# Altium schematic sheet imd-monitoring.SchDoc: imd-monitoring
size A4; Date: 05.10.2017; CheckedBy: UNCHECKED; Author: Leon Loeser; Organization: Baltic Racing; Address1: Zur Schwedenschanze 15; Address2: Haus 18; Address3: 18435 Stralsund; Revision: xx.xx; SheetNumber: 3; SheetTotal: 9; Rules: EV6.3; ProjectName: Projekt
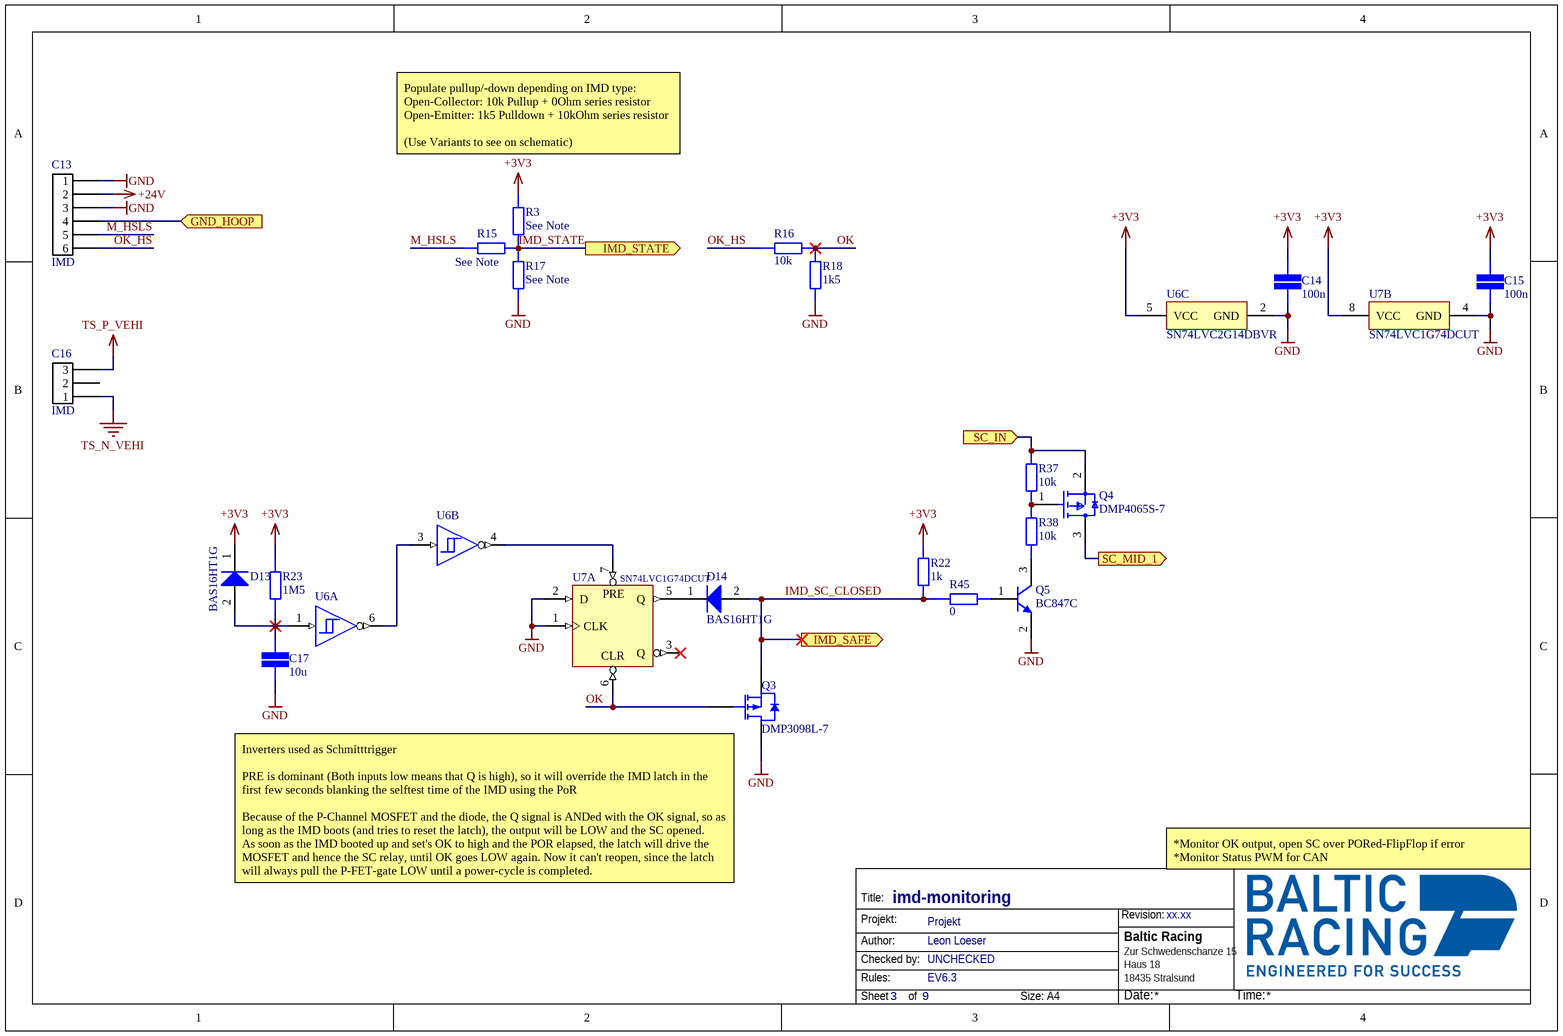
[diagram p0: imd-monitoring.SchDoc]

## Parts
C13  IMD  [43045-0612]
C14  value 100n  [CAP 0603/1608]  (hidden comment: SMD Capacitor)
C15  value 100n  [CAP 0603/1608]  (hidden comment: SMD Capacitor)
C16  IMD  [43650-0315]
C17  value 10u  [CAP 1206/3216]  (hidden comment: SMD Capacitor)
D13  BAS16HT1G  [ONSC-SOD-323-2-477-02_V]
D14  BAS16HT1G  [ONSC-SOD-323-2-477-02_V]
Q3  DMP3098L-7  [DIOD-SOT23-3_V]
Q4  DMP4065S-7  [FP-SOT23-MFG]
Q5  BC847C  [INF-SOT23_L]
R3  value See Note  [STACKPOLE CSR0603]  (hidden comment: SMD Resistor)
R15  value See Note  [STACKPOLE CSR0603]  (hidden comment: SMD Resistor)
R16  value 10k  [STACKPOLE CSR0603]  (hidden comment: SMD Resistor)
R17  value See Note  [STACKPOLE CSR0603]  (hidden comment: SMD Resistor)
R18  value 1k5  [STACKPOLE CSR0603]  (hidden comment: SMD Resistor)
R22  value 1k  [STACKPOLE CSR0603]  (hidden comment: SMD Resistor)
R23  value 1M5  [STACKPOLE CSR0603]  (hidden comment: SMD Resistor)
R37  value 10k  [STACKPOLE CSR0603]  (hidden comment: SMD Resistor)
R38  value 10k  [STACKPOLE CSR0603]  (hidden comment: SMD Resistor)
R45  value 0  [STACKPOLE CSR0603]  (hidden comment: SMD Resistor)
U6  SN74LVC2G14DBVR  [DBV0006A_M]  (value not drawn)  (parts A,B,C of 3)
U7  SN74LVC1G74DCUT  [DCU0008A_N]  (parts A,B of 2)

## Ports
GND_HOOP (in), IMD_SAFE (out), IMD_STATE (out), SC_IN (in), SC_MID_1 (out)

## Nets
+3V3: C14.1 C15.1 D13.1(K) R3.2 R22.2 R23.2 U6.5(VCC) U7.8(VCC)
+24V: C13.2
GND: C13.1 C13.3 C14.2 C15.2 C17.1 Q3.3(D) Q5.2(E) R17.1 R18.1 U6.2(GND) U7.1(CLK) U7.2(D) U7.4(GND)
TS_N_VEHI: C16.1
TS_P_VEHI: C16.3
GND_HOOP: C13.4 ; port GND_HOOP
IMD_SC_CLOSED: D14.2(A) Q3.2(S) R22.1 R45.2 ; port IMD_SAFE
IMD_STATE: R3.1 R15.1 R17.2 ; port IMD_STATE
M_HSLS: C13.5 R15.2
OK: Q3.1(G) R16.1 R18.2 U7.6(~{CLR})
OK_HS: C13.6 R16.2
SC_IN: Q4.2(S) R37.1 ; port SC_IN
SC_MID_1: Q4.3(D) ; port SC_MID_1
NetC17_2: C17.2 D13.2(A) R23.1 U6.1(1A)
NetD14_1: D14.1(K) U7.5(Q)
NetQ4_1: Q4.1(G) R37.2 R38.1
NetQ5_1: Q5.1(B) R45.1
NetQ5_3: Q5.3(C) R38.2
NetU6_3: U6.3(2A) U6.6(1Y)
NetU6_4: U6.4(2Y) U7.7(~{PRE})

Not connected (* = marked no-connect by the designer): C16 2; U7 3(Q)*

## Notes on the sheet
- Populate pullup/-down depending on IMD type:
  Open-Collector: 10k Pullup + 0Ohm series resistor
  Open-Emitter: 1k5 Pulldown + 10kOhm series resistor
  (Use Variants to see on schematic)
- (near Q3) Inverters used as Schmitttrigger
  PRE is dominant (Both inputs low means that Q is high), so it will override the IMD latch in the first few seconds blanking the selftest time of the IMD using the PoR
  Because of the P-Channel MOSFET and the diode, the Q signal is ANDed with the OK signal, so as long as the IMD boots (and tries to reset the latch), the output will be LOW and the SC opened.
  As soon as the IMD booted up and set's OK to high and the POR elapsed, the latch will drive the MOSFET and hence the SC relay, until OK goes LOW again. Now it can't reopen, since the latch will always pull the P-FET-gate LOW until a power-cycle is completed.
- *Monitor OK output, open SC over PORed-FlipFlop if error
  *Monitor Status PWM for CAN
- Title:
- Projekt:
- Revision:
- Author:
- Rules:
- Checked by:
- Sheet
- of
- Size:
- A4
- Date:
- Time:
- (in symbol CMP-0859-00687-3, part A) PRE; CLR

## Library data of the parts
C13 = MicroFit3.0 6-Pin: Molex MicroFit3.0 6-Pin
C14 C15 C17 = SMD Capacitor: Capacitor with multiple Footprints; Voltage: 6.3V
C16 = MicroFit3.0 3-Pin: Molex MicroFit3.0 3-Pin
D13 D14 = CMP-1054-00068-1: Switching Diode, 2-Pin SOD-323, Pb-Free, Tape and Reel; Manufacturer: On Semiconductor; Configuration: Single; IF Max (A): 0.2; trr Max (ns): 6; Packing: Tape and Reel; ComponentLink2URL: http://www.onsemi.com/pub_link/Collateral/BAS16HT1-D.PDF; ComponentLink3Description: Package Specification; RoHS: TRUE; PackageDescription: 2-Pin SOD, Body 1.7 x 1.25 mm; PackageReference: SOD-323-2-477-02; PartNumber: BAS16HT1G; ComponentLink1URL: http://www.onsemi.com/; Mounting Technology: Surface Mount; ComponentLink1Description: Manufacturer URL; ComponentLink2Description: Datasheet; DatasheetVersion: Rev. 11; PackageVersion: Rev. H, 03/2007; ComponentLink3URL: http://www.onsemi.com/pub_link/Collateral/477-02.PDF.1
Q3 = CMP-0697-00001-2: P-Channel Enhancement Mode MOSFET, -30 V VDS, -55 to 155 degC, 3-Pin SOT23, RoHS, Tape and Reel; Manufacturer: Diodes Inc; PD (TA: 25 degC)=1.08 W; VGS: +/- 20 V; VDS: -30 V; IDS (TA: 25 degC)=-3.8 A; RDS(on) (Max.) (VGS: 4.5 V)=120 mOhm; VGS(th) (Max.): -2.1 V; ComponentLink3Description: Package Specification; ComponentLink3URL: http://www.diodes.com/datasheets/ap02002.pdf; PackageDescription: 3-Pin Small Outline Transistor, Body 1.3 x 2.9 mm, Pitch 0.95 mm; PackageReference: SOT23; PartNumber: DMP3098L-7; ComponentLink1Description: Manufacturer URL; ComponentLink2Description: Datasheet; ComponentLink2URL: http://www.diodes.com/datasheets/ds31447.pdf; ComponentLink1URL: http://www.diodes.com/; DatasheetVersion: Rev. 8 - 2; Mounting Technology: Surface Mount; RoHS: TRUE; Packing: Tape and Reel; PackageVersion: Rev. 75; Operating Temperature Range: -55 to 150 degC
Q4 = CMP-12801-000050-1: MOSFET P-CH 40V 2.4A SOT23; Manufacturer: Diodes Inc.; Number Of Channels: 1; Max Junction Temp: +150°C; Standoff Height: 0.013mm; Power Dissipation: 0.72W; Turn Off Delay Time: 36.3ns; Rthja Max: 171°C/W; Typ Forward Diode Voltage: -0.7V; Max Forward Diode Voltage: -1.2V; Drain To Source Voltage: -40V; Threshold Vgs Min: -1V; Gate To Source Voltage: 20V; Depletion Mode: False; Input Capacitace At Vds: 587pF @ -20V; Drain To Source Resistance: 64mΩ; Turn On Delay Time: 3.6ns; Continuous Drain Current: -2.4A; Pulse Drain Current: -20A; Gate Charge At Vgs: 12.2nC @ -10V; Threshold Vgs Max: -3V; Octopart: https://octopart.com/dmp4065s-7-diodes+inc.-57605044; Footprint Url: https://www.diodes.com/assets/Package-Files/SOT23.pdf; Device Class L2: Transistors; Package: SOT23; Number Of P Channels: 1; ComponentLink2URL: https://www.diodes.com/assets/Datasheets/DMP4065S.pdf; Temperature Range High: +150°C; Device Class L1: Discrete Semiconductors; Temperature Range Low: -55°C; Manufacturer Part Number: DMP4065S-7; ComponentLink2Description: Datasheet; Lead Free: Yes; Temperature: -55°C to +150°C; Drain To Source Breakdown Voltage: -40V; Category: Trans; Height: 1.1mm; Digikey Description: MOSFET P-CH 40V 2.4A SOT23; Ipc Land Pattern Name: SOT92P240X102-3; Device Class L3: MOSFETs; RoHS: TRUE; Mouser Description: Trans MOSFET P-CH 40V 2.4A Automotive 3-Pin SOT-23 T/R; Automotive: No
Q5 = CMP-1177-00037-1: NPN Silicon AF Transistor, 45 V VCEO, 100 mA IC, SOT23, Reel, Green; Manufacturer: Infineon; VCEO (max): 45Â V; VEBO (max): 6Â V; fT (typ): 250Â MHz; VCBO (max): 50Â V; ICM (max): 200Â mA; Green: TRUE; IC (max): 100Â mA; Ptot (max): 330Â mW; ICBO (max): 15Â nA; PartNumber: BC847C; ComponentLink3URL: http://www.infineon.com/dgdl/SOT23-Package_Overview.pdf?folderId=db3a30431936bc4b0119532290053c66&fileId=db3a30431936bc4b0119533468123c85; ComponentLink3Description: Package Specification; Mounting Technology: Surface Mount; PackageDescription: 3-Pin Small Outline Transistor Package, 1.3 x 2.9 mm Body, 0.95 mm Pitch; PackageReference: SOT23; ComponentLink2URL: http://www.infineon.com/dgdl/bc847series_bc848series_bc849series_bc850series.pdf?folderId=db3a304314dca389011541d30fa21656&fileId=db3a304314dca389011541d4630a1657; ComponentLink2Description: Datasheet; ComponentLink1Description: Manufacturer URL; Polarity: NPN; ComponentLink1URL: http://www.infineon.com/; IBM (max): 200Â mA; Packing: Reel; PackageVersion: Apr-08
R3 R15-R18 R22 R23 R37 R38 R45 = SMD Resistor: Resistor with multiple footprints
U6 = CMP-0859-00232-4: Dual Schmitt-Trigger Inverter, DBV0006A, LARGE T&R; Manufacturer: Texas Instruments; Voltage(Nom)(V): 1.8,2.5,3.3,5; Sub-Family: Inverting Buffer/Driver; ICC @ Nom Voltage(Max)(mA): 0.01; tpd @ Nom Voltage(Max)(ns): 9.5,5.7,5.4,4.3; Schmitt Trigger: Yes; Rating: Catalog; Bits(#): 2; Technology Family: LVC; Output Drive (IOL/IOH)(Max)(mA): 32/-32; VCC(Max)(V): 5.5; Output Type: CMOS; F @ Nom Voltage(Max)(Mhz): 150; Input Type: CMOS/TTL; Logic: Inverting; 3-State Output: No; VCC(Min)(V): 1.65; DatasheetVersion: SCES200M; Generic Part Number: SN74LVC2G14; PackageReference: DBV0006A; Operating Temperature Range(C): -40 to 125
U7 = CMP-0859-00687-3: Single Positive-Edge-Triggered D-Type Flip-Flop With Clear and Preset, DCU0008A, SMALL T&R; Manufacturer: Texas Instruments; Schmitt Trigger: No; Technology Family: LVC; VCC(Min)(V): 1.65; F @ Nom Voltage(Max)(Mhz): 150; ICC @ Nom Voltage(Max)(mA): 0.01; Voltage(Nom)(V): 1.8,2.5,3.3,5; VCC(Max)(V): 5.5; Output Type: CMOS; Logic: True; tpd @ Nom Voltage(Max)(ns): 13.4,7.1,5.9,4.1; Input Type: CMOS/TTL; Output Drive (IOL/IOH)(Max)(mA): 32/-32; Rating: Catalog; Bits(#): 1; Operating Temperature Range(C): -40 to 125; PackageReference: DCU0008A; DatasheetVersion: SCES794E; Sub-Family: D-Type Flip-Flop; 3-State Output: No; Generic Part Number: SN74LVC1G74